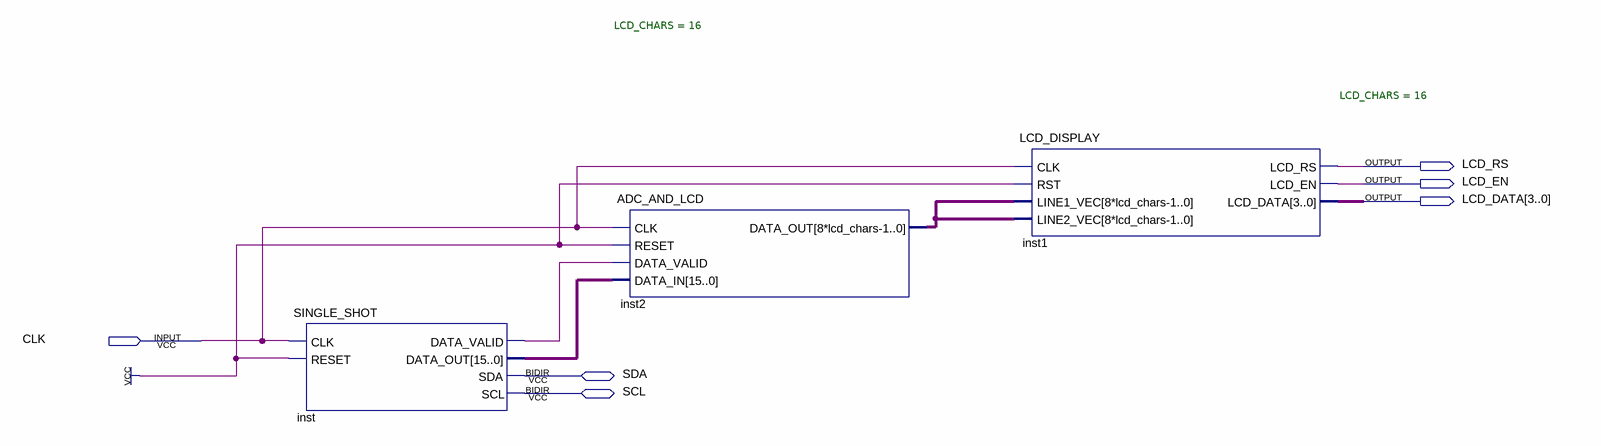
[diagram p0: schematic sheet]
// Quartus schematic LCD_OUT.bdf as structural Verilog: 3 symbols, 6 pins
module LCD_OUT (
  input  CLK,
  inout  SDA,
  inout  SCL,
  output LCD_RS,
  output LCD_EN,
  output [3:0] LCD_DATA
);

  wire inst_data_valid;
  wire [15:0] inst_data_out;
  wire [127:0] inst2_data_out;

  SINGLE_SHOT inst (
    .CLK(CLK), .RESET(1'b1), .DATA_VALID(inst_data_valid), .DATA_OUT(inst_data_out), .SDA(SDA), .SCL(SCL));
  ADC_AND_LCD #(.LCD_CHARS(16)) inst2 (
    .CLK(CLK), .RESET(1'b1), .DATA_VALID(inst_data_valid), .DATA_IN(inst_data_out), .DATA_OUT(inst2_data_out));
  LCD_DISPLAY #(.LCD_CHARS(16)) inst1 (
    .CLK(CLK), .RST(1'b1), .LINE1_VEC(inst2_data_out), .LINE2_VEC(inst2_data_out), .LCD_RS(LCD_RS),
    .LCD_EN(LCD_EN), .LCD_DATA(LCD_DATA));
endmodule
